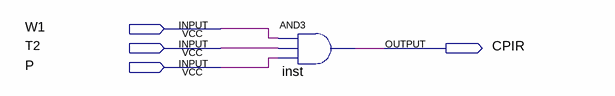
[diagram p0: schematic sheet]
// Quartus schematic CPIR.bdf as structural Verilog: 1 symbols, 4 pins
module CPIR (
  input  W1,
  input  T2,
  input  P,
  output CPIR
);

  and inst (CPIR, W1, T2, P);
endmodule
